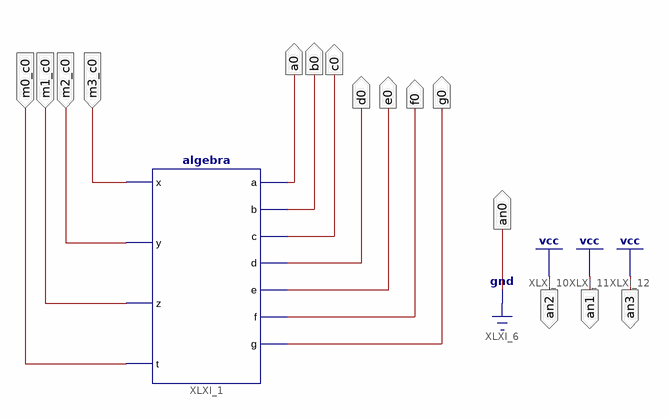
[diagram p0: schematic sheet 1]
// Xilinx ISE schematic schema.sch (spartan3e) as structural Verilog: 1 symbols, 15 ports
module schema (
  input  m3_c0,
  input  m2_c0,
  input  m1_c0,
  input  m0_c0,
  output a0,
  output b0,
  output c0,
  output g0,
  output f0,
  output d0,
  output e0,
  output an2,
  output an1,
  output an3,
  output an0
);

  algebra XLXI_1 (.x(m3_c0), .y(m2_c0), .z(m1_c0), .t(m0_c0), .a(a0), .b(b0), .c(c0), .d(d0), .e(e0), .f(f0), .g(g0));

  assign an0 = 1'b0;
  assign an1 = 1'b1;
  assign an2 = 1'b1;
  assign an3 = 1'b1;
endmodule
